# EAGLE design board (EAGLE 7.2.0)
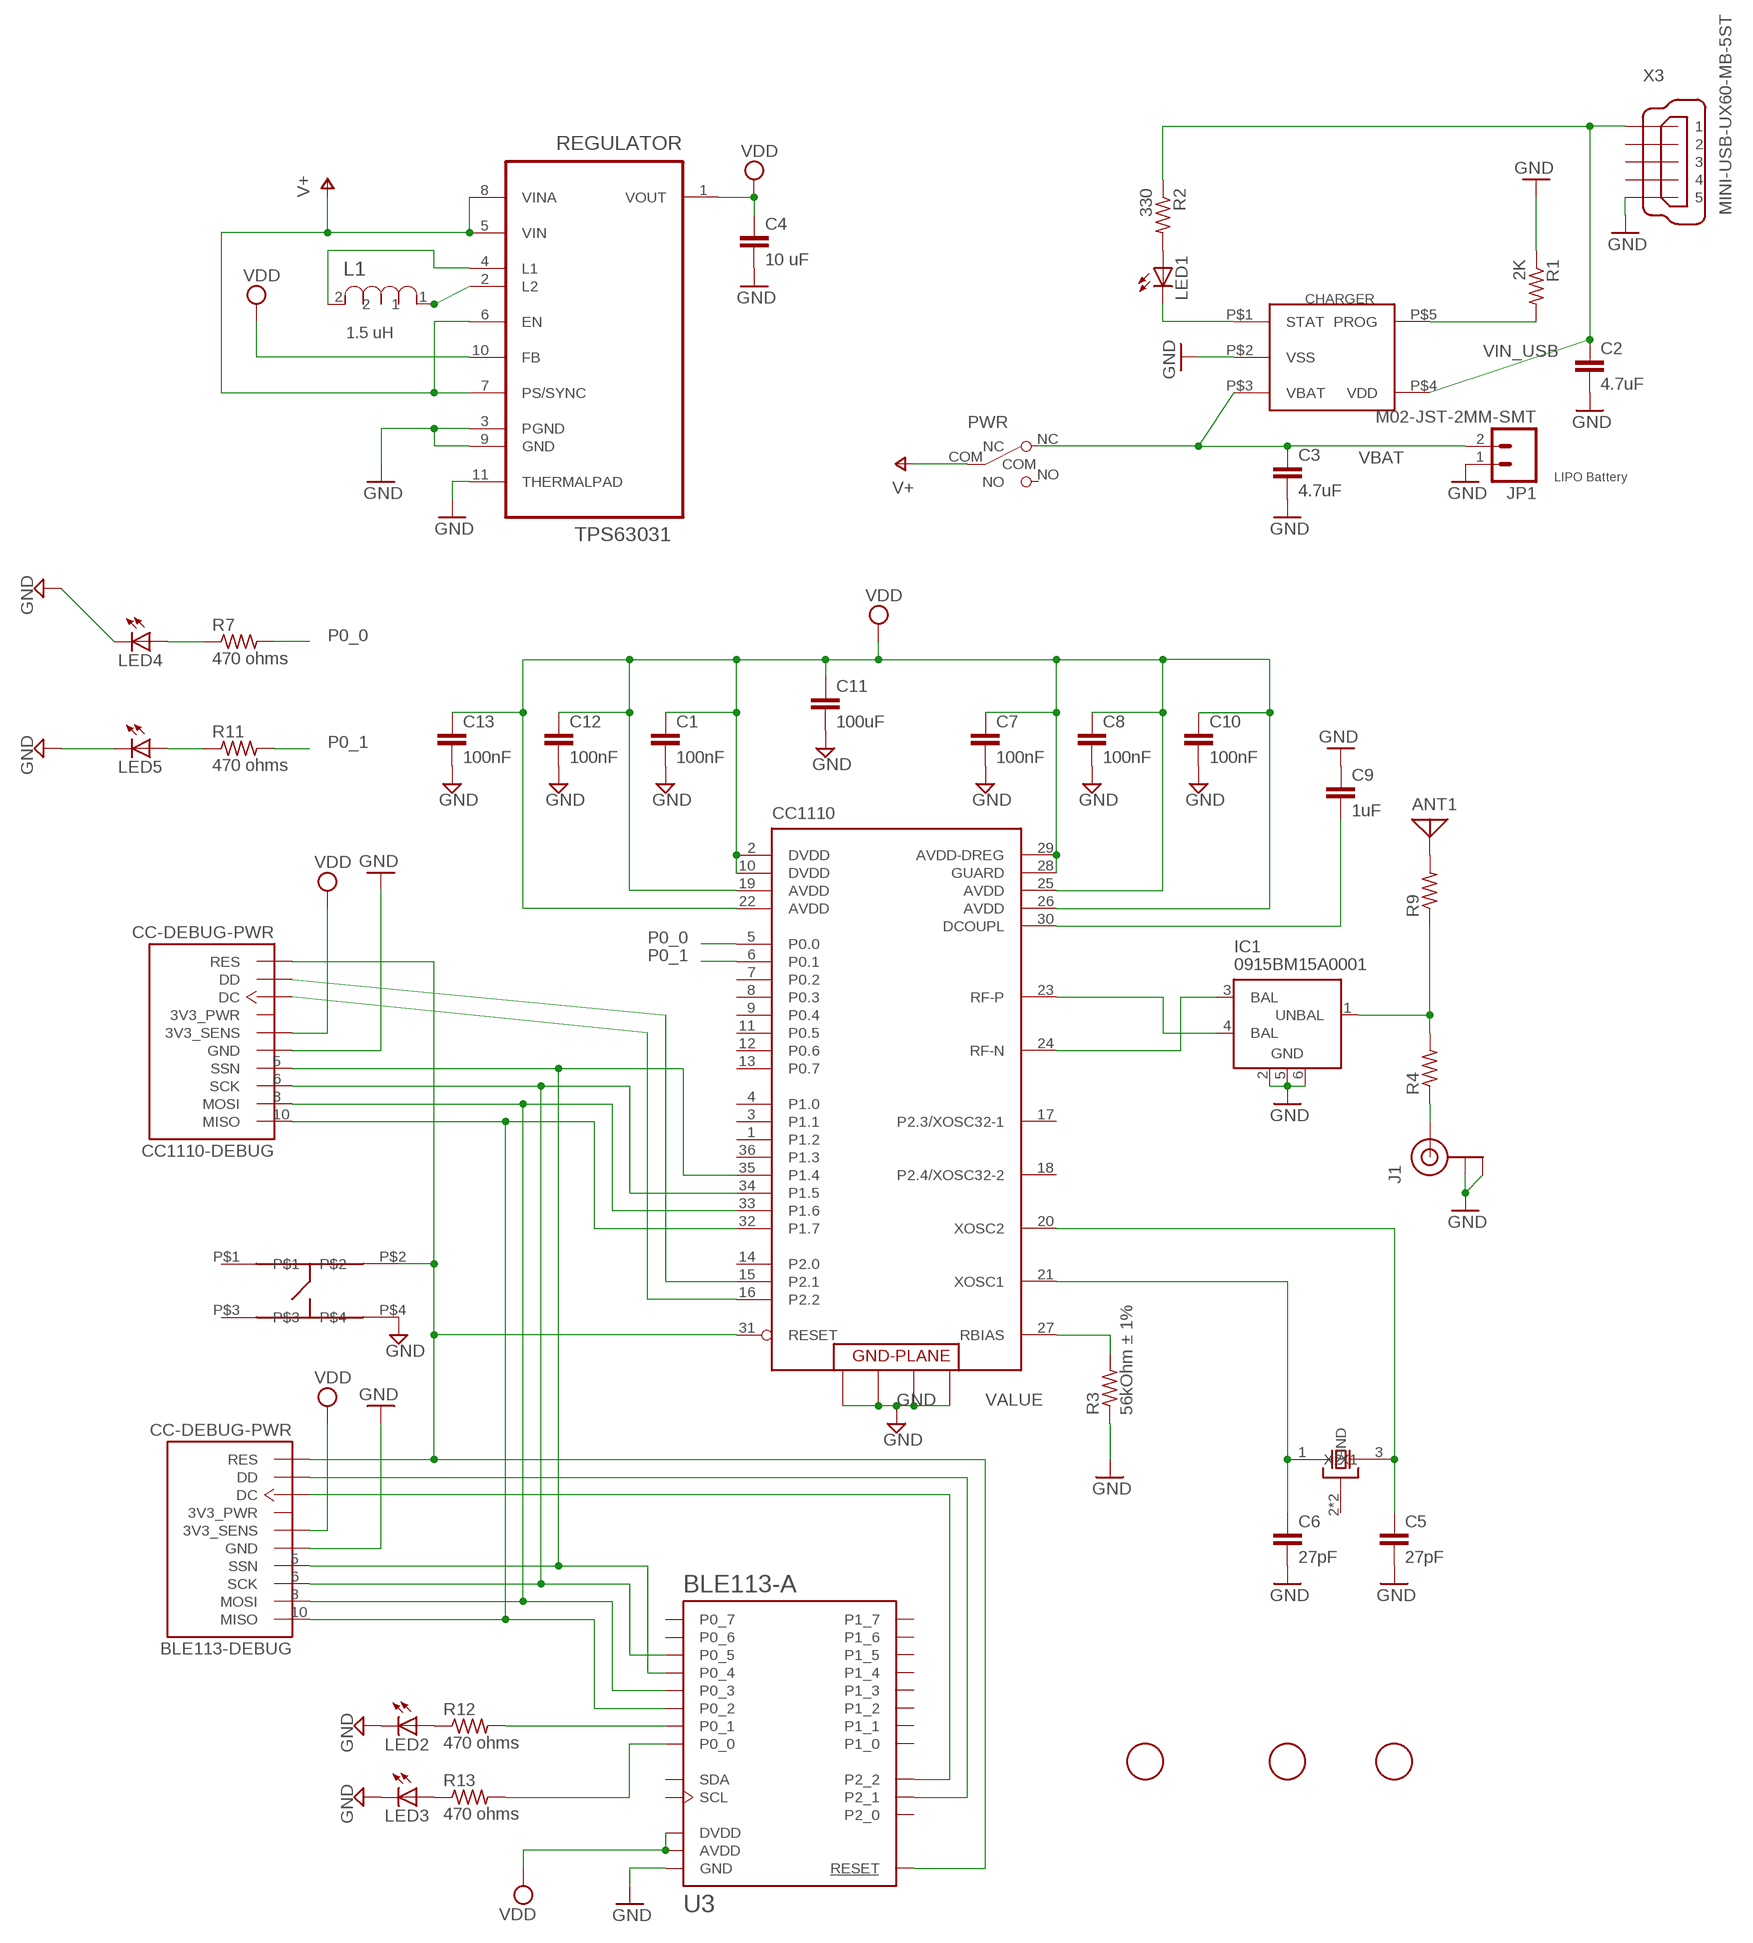
[diagram p0: schematic, sheet 1]

## Parts
ANT1  ANTENNA  [PAD-01]
BLE113-DEBUG  CC-DEBUG-PWR  [CC-P05]
C1  100nF  C-EUC0402  [C0402]
C2  4.7uF  C-EUC0402K  [C0402K]
C3  4.7uF  C-EUC0603K  [C0603K]
C4  10 uF  C-EUC0805K  [C0805K]
C5  27pF  C-EUC0402K  [C0402K]
C6  27pF  C-EUC0402K  [C0402K]
C7  100nF  C-EUC0402  [C0402]
C8  100nF  C-EUC0402  [C0402]
C9  1uF  C-EUC0402K  [C0402K]
C10  100nF  C-EUC0402  [C0402]
C11  100uF  C-EUC0402  [C0402]
C12  100nF  C-EUC0402  [C0402]
C13  100nF  C-EUC0402  [C0402]
CC1110  CC1110  [QLP-36_UPDATE]
CC1110-DEBUG  CC-DEBUG-PWR  [CC-P05]
CHARGER  MCP73831  [5PIN_SOT23]
FID1  FIDUCIAL  [FIDUCIAL_1MM]
FID2  FIDUCIAL  [FIDUCIAL_1MM]
FID3  FIDUCIAL  [FIDUCIAL_1MM]
IC1  0915BM15A0001  [0915BM15A0001]
J1  U.FL  [U.FL]
JP1  M02-JST-2MM-SMT  [JST-2-SMD]
L1  1.5 uH  PM0603-R12J-RC  [INDC1610X12N]
LED1  LEDSML0603  [SML0603]
LED2  LEDSML0603  [SML0603]
LED3  LEDSML0603  [SML0603]
LED4  LEDSML0603  [SML0603]
LED5  LEDSML0603  [SML0603]
PWR  SW_SLIDE  [SLIDE_SWITCH_SMD]
R1  2K  R-US_R0402  [R0402]
R2  330  R-US_R0402  [R0402]
R3  56kOhm ± 1%  R-US_R0402  [R0402]
R4  R-US_R0402  [R0402]
R7  470 ohms  R-US_R0402  [R0402]
R9  R-US_R0402  [R0402]
R11  470 ohms  R-US_R0402  [R0402]
R12  470 ohms  R-US_R0402  [R0402]
R13  470 ohms  R-US_R0402  [R0402]
REGULATOR  TPS63031  [SON50P260X260X80-11N]
U3  BLE113-A  [BLE113-A]
U$2  TACTILE_SWITCH  [PTS540]
X1  26MHz 10pF 10ppm -20C +70C  CTS_32X25_SMD  [CTS_32X25]
X3  MINI-USB-UX60-MB-5ST  [UX60-MB-5ST]

## Nets
DC: CC1110-DEBUG.3(DC) CC1110.16(P2.2)
DC_BLE: BLE113-DEBUG.3(DC) U3.P2_2
DD: CC1110-DEBUG.4(DD) CC1110.15(P2.1)
DD_BLE: BLE113-DEBUG.4(DD) U3.P2_1
GND: BLE113-DEBUG.1(GND) C1.2 C2.2 C3.2 C4.2 C5.2 C6.2 C7.2 C8.2 C9.1 C10.2 C11.2 C12.2 C13.2 CC1110-DEBUG.1(GND) CC1110.37(GND) CC1110.38(GND) CC1110.39(GND) CC1110.40(GND) CHARGER.P$2(VSS) IC1.2(GND) IC1.5(GND) IC1.6(GND) J1.P$1(GND) J1.P$2(GND) JP1.1 LED2.C LED3.C LED4.C LED5.C R1.1 R3.1 REGULATOR.3(PGND) REGULATOR.9(GND) REGULATOR.11(THERMALPAD) U3.GND U3.GND@2(GND) U3.GND@3(GND) U3.GND@4(GND) U3.GND@5(GND) U3.GND@6(GND) U3.GND@7(GND) U3.GND@8(GND) U3.GND@9(GND) U3.GND@10(GND) U$2.P$4 X3.5
MISO: BLE113-DEBUG.10(MISO) CC1110-DEBUG.10(MISO) CC1110.32(P1.7) U3.P0_2
MOSI: BLE113-DEBUG.8(MOSI) CC1110-DEBUG.8(MOSI) CC1110.33(P1.6) U3.P0_3
N$1: L1.1 REGULATOR.2(L2)
N$2: CHARGER.P$1(STAT) LED1.C
N$3: CHARGER.P$5(PROG) R1.2
N$4: LED1.A R2.2
N$5: CC1110.24(RF-N) IC1.3(BAL)
N$6: L1.2 REGULATOR.4(L1)
N$7: CC1110.23(RF-P) IC1.4(BAL)
N$9: J1.P$3(SIGNAL) R4.1
N$10: IC1.1(UNBAL) R4.2 R9.1
N$12: ANT1.1 R9.2
N$14: CC1110.27(RBIAS) R3.2
N$18: C9.2 CC1110.30(DCOUPL)
N$20: C6.1 CC1110.21(XOSC1) X1.1(X1)
N$21: C5.1 CC1110.20(XOSC2) X1.3(X2)
N$24: LED4.A R7.1
N$25: LED5.A R11.1
N$29: LED2.A R12.1
N$30: LED3.A R13.1
N$31: R12.2 U3.P0_1
N$32: R13.2 U3.P0_0
P0_0: CC1110.5(P0.0) R7.2
P0_1: CC1110.6(P0.1) R11.2
RESET: BLE113-DEBUG.7(RES) CC1110-DEBUG.7(RES) CC1110.31(RESET) U3.RESET U$2.P$2
SCK: BLE113-DEBUG.6(SCK) CC1110-DEBUG.6(SCK) CC1110.34(P1.5) U3.P0_5
SSN: BLE113-DEBUG.5(SSN) CC1110-DEBUG.5(SSN) CC1110.35(P1.4) U3.P0_4
V+: PWR.COM REGULATOR.5(VIN) REGULATOR.6(EN) REGULATOR.7(PS/SYNC) REGULATOR.8(VINA)
VBAT: C3.1 CHARGER.P$3(VBAT) JP1.2 PWR.NC
VDD: BLE113-DEBUG.2(3V3_SENS) C1.1 C4.1 C7.1 C8.1 C10.1 C11.1 C12.1 C13.1 CC1110-DEBUG.2(3V3_SENS) CC1110.2(DVDD) CC1110.10(DVDD) CC1110.19(AVDD) CC1110.22(AVDD) CC1110.25(AVDD) CC1110.26(AVDD) CC1110.28(GUARD) CC1110.29(AVDD-DREG) REGULATOR.1(VOUT) REGULATOR.10(FB) U3.AVDD U3.DVDD
VIN_USB: C2.1 CHARGER.P$4(VDD) R2.1 X3.1
Unconnected: BLE113-DEBUG.9(3V3_PWR) CC1110-DEBUG.9(3V3_PWR) CC1110.1(P1.2) CC1110.3(P1.1) CC1110.4(P1.0) CC1110.7(P0.2) CC1110.8(P0.3) CC1110.9(P0.4) CC1110.11(P0.5) CC1110.12(P0.6) CC1110.13(P0.7) CC1110.14(P2.0) CC1110.17(P2.3/XOSC32-1) CC1110.18(P2.4/XOSC32-2) CC1110.36(P1.3) PWR.NO U3.P0_6 U3.P0_7 U3.P1_0 U3.P1_1 U3.P1_2 U3.P1_3 U3.P1_4 U3.P1_5 U3.P1_6 U3.P1_7 U3.P2_0 U3.SCL U3.SDA U$2.P$1 U$2.P$3 X3.2 X3.3 X3.4

## Notes on the sheet
- LIPO Battery

## Power pins joined to a net without a drawn wire
GND: X1.2(GND) X1.4(GND)

## Library data of the parts
ANT1 = discrete:ANTENNA: Antenna
BLE113-DEBUG CC1110-DEBUG = parts:CC-DEBUG-PWR: CC debugger connection with various form factors. 2x5-pin 0.05" pitch header include Pin 9 (VDD) supply connection as separate pin. https://github.com/jrowberg/sf-oshw Last updated 2014-01-04 by Jeff Rowberg <jeff@rowberg.net>
C1-C13 = rcl:C-EU: CAPACITOR
CC1110 = parts:CC1110: True System-on-Chip with Low Power RF Transceiver and 8051 MCU
CHARGER = parts:MCP73831: Digikey No:- __MCP73831T-2ACI/OTCT-ND__
FID1-FID3 = adafruit:FIDUCIAL: For use by pick and place machines to calibrate the vision/machine, 1mm By microbuilder.eu
IC1 = parts:0915BM15A0001: 915 MHz Impedance Matched Balun-Filter For TI CC11xx Chipset family Data sheet <http://www.johansontechnology.com/datasheets/chipset-specific/0915BM15A0001.pdf>
J1 = SparkFun-Connectors:U.FL: SMD antenna connector- WRL-09144; PROD_ID: CONN-09193
JP1 = SparkFun-Connectors:M02: Standard 2-pin 0.1" header. Use with - straight break away headers ( PRT-00116) - right angle break away headers (PRT-00553) - swiss pins (PRT-00743) - machine pins (PRT-00117) - female headers (PRT-00115) Molex polarized connector foot print use with: PRT-08233 with associated crimp pins and housings. 2.54_SCREWTERM for use with PRT-10571. 3.5mm Screw Terminal footprints for PRT-08084 5mm Screw Terminal footprints for use with PRT-08432; PROD_ID: CONN-08352
L1 = Bourns_By_element14_Batch_1:PM0603-R12J-RC: CHIP INDUCTOR, 120NH, 300MA, 5%, 1300MHZ; MPN: PM0603-R12J-RC; OC_FARNELL: -; OC_NEWARK: 86K1771; SUPPLIER: BOURNS; TOLERANCE: ±5 %; VALUE: 120 nH
LED1-LED5 = led:LED: LED OSRAM: - CHIPLED LG R971, LG N971, LY N971, LG Q971, LY Q971, LO R971, LY R971 LH N974, LH R974 LS Q976, LO Q976, LY Q976 LO Q996 - Hyper CHIPLED LW Q18S LB Q993, LB Q99A, LB R99A - SideLED LS A670, LO A670, LY A670, LG A670, LP A670 LB A673, LV A673, LT A673, LW A673 LH A674 LY A675 LS A676, LA A676, LO A676, LY A676, LW A676 LS A679, LY A679, LG A679 - Hyper Micro SIDELED® LS Y876, LA Y876, LO Y876, LY Y876 LT Y87S - SmartLED LW L88C, LW L88S LB L89C, LB L89S, LG L890 LS L89K, LO L89K, LY L89K LS L896, LA L896, LO L896, LY L896 - TOPLED LS T670, LO T670, LY T670, LG T670, LP T670 LSG T670, LSP T670, LSY T670, LOP T670, LYG T670 LG T671, LOG T671, LSG T671 LB T673, LV T673, LT T673, LW T673 LH T674 LS T676, LA T676, LO T676, LY T676, LB T676, LH T676, LSB T676, LW T676 LB T67C, LV T67C, LT T67C, LS T67K, LO T67K, LY T67K, LW E67C LS E67B, LA E67B, LO E67B, LY E67B, LB E67C, LV E67C, LT E67C LW T67C LS T679, LY T679, LG T679 LS T770, LO T770, LY T770, LG T770, LP T770 LB T773, LV T773, LT T773, LW T773 LH T774 LS E675, LA E675, LY E675, LS T675 LS T776, LA T776, LO T776, LY T776, LB T776 LHGB T686 LT T68C, LB T68C - Hyper Mini TOPLED® LB M676 - Mini TOPLED Santana® LG M470 LS M47K, LO M47K, LY M47K Source: http://www.osram.convergy.de LUXEON: - LUMILED® LXK2-PW12-R00, LXK2-PW12-S00, LXK2-PW14-U00, LXK2-PW14-V00 LXK2-PM12-R00, LXK2-PM12-S00, LXK2-PM14-U00 LXK2-PE12-Q00, LXK2-PE12-R00, LXK2-PE12-S00, LXK2-PE14-T00, LXK2-PE14-U00 LXK2-PB12-K00, LXK2-PB12-L00, LXK2-PB12-M00, LXK2-PB14-N00, LXK2-PB14-P00, LXK2-PB14-Q00 LXK2-PR12-L00, LXK2-PR12-M00, LXK2-PR14-Q00, LXK2-PR14-R00 LXK2-PD12-Q00, LXK2-PD12-R00, LXK2-PD12-S00 LXK2-PH12-R00, LXK2-PH12-S00 LXK2-PL12-P00, LXK2-PL12-Q00, LXK2-PL12-R00 Source: www.luxeon.com KINGBRIGHT: KA-3528ASYC Source: www.kingbright.com
PWR = parts:SW_SLIDE
R1-R4 R7 R9 R11-R13 = rcl:R-US_: RESISTOR
REGULATOR = Texas Instruments_By_element14_Batch_1:TPS63031: HIGH EFFICIENCY SINGLE INDUCTOR BUCK-BOOST CONVERTER WITH 1-A SWITCHES; MPN: TPS63031; OC_FARNELL: 1686303; OC_NEWARK: 19P7478; PACKAGE: SON-10; SUPPLIER: Texas Instruments
U3 = sf-bluegiga:BLE113: Bluetooth Low Energy single-mode module - Bluetooth 4.0 (CC2541). BLE113-A variant has an on-module ceramic chip antenna. BLE113-A variant includes keepout/restrict area. Antenna edge of the module should be flush up against the edge of the PCB. See datasheet for variant layout details. The BLE113 is a Bluetooth Smart module targeted for small and low-power sensors and accessories. It integrates all features required for a Bluetooth Smart application, including Bluetooth radio, software stack, and GATT-based profiles. The BLE113 Bluetooth Smart module can also host end-user applications, which means no external micro controller is required in size or price constrained devices. Moreover, it has flexible hardware interfaces to connect to different peripherals and sensors and can be powered directly from a standard 3V coin cell battery or a pair of AAA batteries. In the lowest power sleep mode it merely consumes 500 nA and will wake up within a few hundred microseconds. The BLE113 Bluetooth Smart module conusmer approximately 30% less power and is smaller than the BLE112 Bluetooth Smart Module. http://www.bluegiga.com/en-US/products/bluetooth-4.0-modules/ble113-bluetooth--smart-module https://github.com/jrowberg/sf-oshw Last updated 2014-01-04 by Jeff Rowberg <jeff@rowberg.net>; ANTENNA: On-module ceramic chip antenna
U$2 = parts:TACTILE_SWITCH: Ultra Low Profile SMT Top Actuated PTS540 JM035 SMTR LFS Datasheet <http://www.mouser.com/ds/2/60/PTS540_9sept14-372441.pdf>
X1 = cts_crystal:CTS_32X25_SMD
X3 = con-hirose:MINI-USB-: MINI USB Connector Source: http://www.hirose.co.jp/cataloge_hp/e24000019.pdf; OC_FARNELL: unknown; OC_NEWARK: unknown

## Board
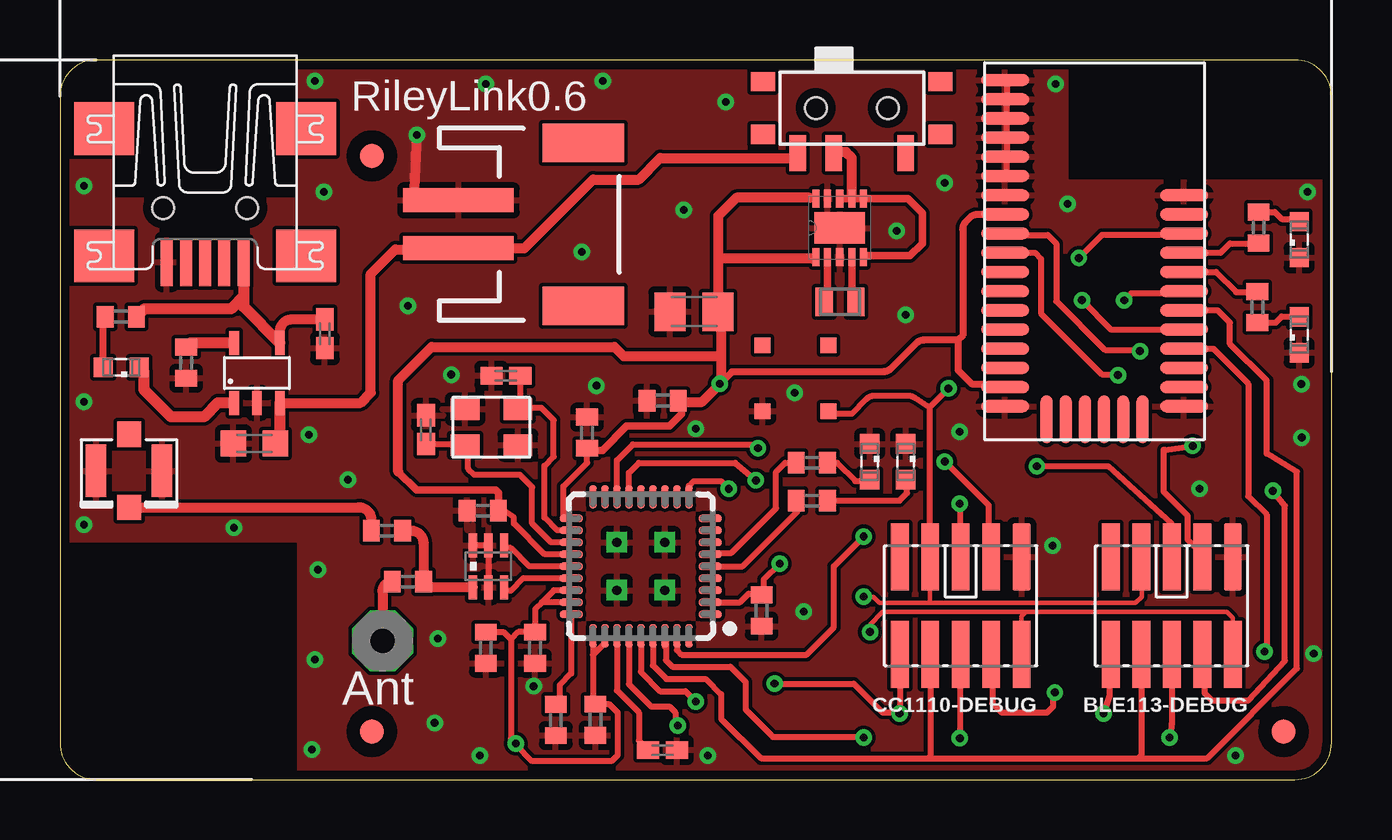
[diagram p1: board, top side]
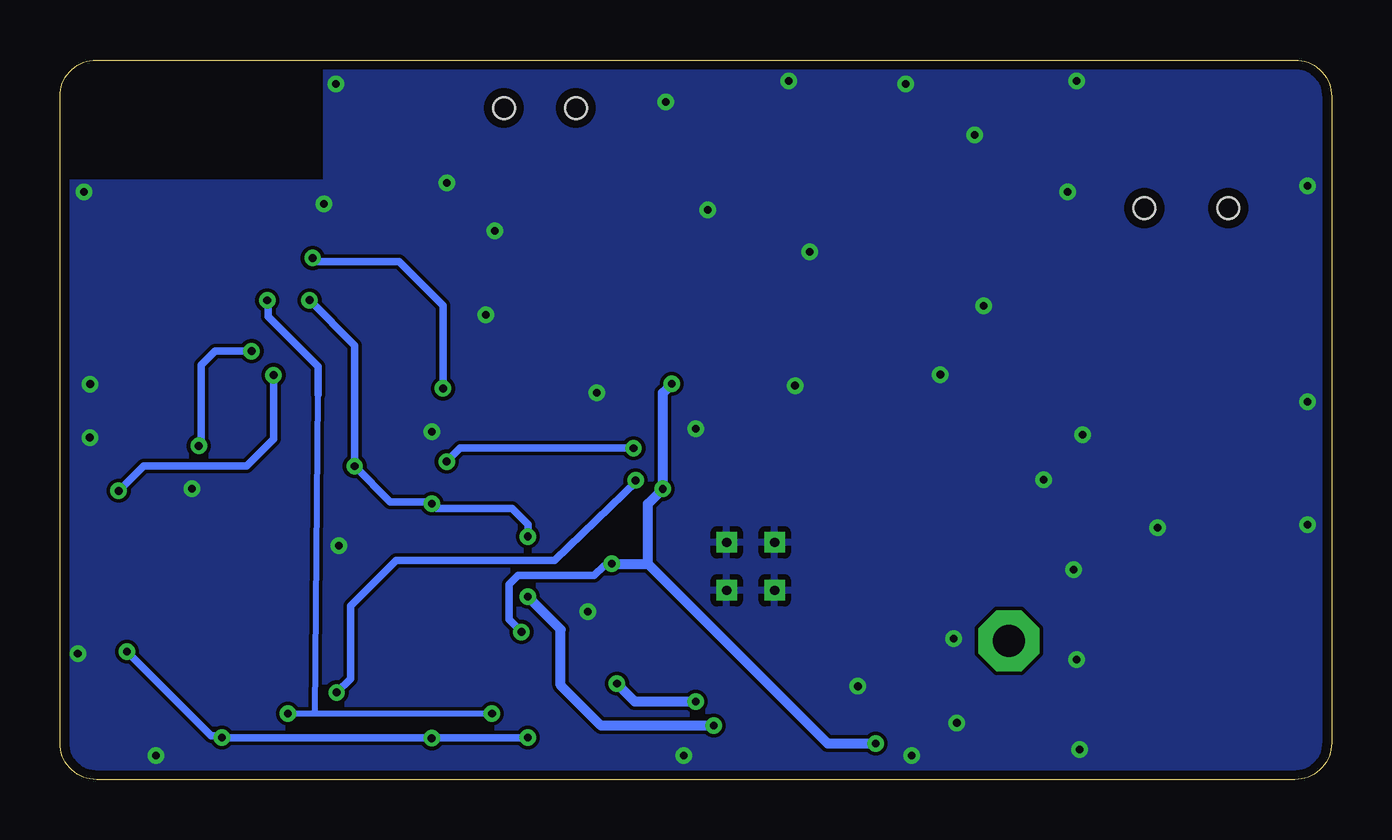
[diagram p2: board, bottom side, seen from below]

Size 53 x 30 mm. Coordinates in mm from the lower left corner, seen from the top.
Outline: 0,28.48 0,1.52 arc90 1.52,0 51.48,0 arc90 53,1.52 53,28.48 arc90 51.48,30 1.52,30 arc90 0,28.48
Copper layers (1*16): Top 0.0356mm / dielectric 1.5011mm / Bottom 0.0356mm
Design rules "oshpark *": minimum track width 6mil, minimum drill 13mil, track to track 6mil, track to pad 6mil, pad to pad 6mil, via to via 6mil, smd to smd 6mil, copper to edge 15mil, drill to drill 6mil, minimum pad ring 7mil, minimum via ring 7mil, stop-mask expansion 3mil, vias tented up to drill 21mil, thermal gap 10mil

### Footprints (pad centres in the part's own frame; a part is rotated, then mirrored left to right if it is on the bottom)
PAD-01 = drill 1.321 pad 2.54 octagon: 1 0,0
CC-P05 = smd 0.74 x 2.8: 1 -2.54,-2.03; 2 -2.54,2.03; 3 -1.27,-2.03; 4 -1.27,2.03; 5 0,-2.03; 6 0,2.03; 7 1.27,-2.03; 8 1.27,2.03; 9 2.54,-2.03; 10 2.54,2.03
C0402 = smd 0.7 x 0.9: 1 -0.65,0; 2 0.65,0
C0402K = smd 0.925 x 0.74: 1 -0.6,0; 2 0.6,0
C0603K = smd 1.05 x 1.08: 1 -0.875,0; 2 0.875,0
C0805K = smd 1.3 x 1.6: 1 -1,0; 2 1,0
QLP-36_UPDATE = smd 0.95 x 0.3: 1 -2.9,2; 2 -2.9,1.5; 3 -2.9,1; 4 -2.9,0.5; 5 -2.9,0; 6 -2.9,-0.5; 7 -2.9,-1; 8 -2.9,-1.5; 9 -2.9,-2; 19 2.9,-2; 20 2.9,-1.5; 21 2.9,-1; 22 2.9,-0.5; 23 2.9,0; 24 2.9,0.5; 25 2.9,1; 26 2.9,1.5; 27 2.9,2 | smd 0.3 x 0.95: 10 -2,-2.9; 11 -1.5,-2.9; 12 -1,-2.9; 13 -0.5,-2.9; 14 0,-2.9; 15 0.5,-2.9; 16 1,-2.9; 17 1.5,-2.9; 18 2,-2.9; 28 2,2.9; 29 1.5,2.9; 30 1,2.9; 31 0.5,2.9; 32 0,2.9; 33 -0.5,2.9; 34 -1,2.9; 35 -1.5,2.9; 36 -2,2.9 | drill 0.381 pad 0.85 square: 37 -1,1; 38 1,1; 39 -1,-1; 40 1,-1
5PIN_SOT23 = smd 0.4 x 1: P$1 0.4,-0.63; P$2 1.35,-0.63; P$3 2.3,-0.63; P$4 2.3,1.87; P$5 0.4,1.87
FIDUCIAL_1MM = smd 1 x 1: 1 0,0
0915BM15A0001 = smd 0.35 x 1: 1 -0.65,-0.875; 2 0,-0.875; 3 0.65,-0.875; 4 0.65,0.875; 5 0,0.875; 6 -0.65,0.875
U.FL = smd 2.2 x 0.85: P$1 0,1.375; P$2 0,-1.375 | smd 1.05 x 1: P$3 1.525,0; P$4 -1.525,0
JST-2-SMD = smd 1 x 4.6: 1 -1,-3.7; 2 1,-3.7 | smd 1.6 x 3.4: NC1 -3.4,1.5; NC2 3.4,1.5
INDC1610X12N = smd 0.711 x 1.194: 1 -0.66,0; 2 0.66,0
SML0603 = smd 0.8 x 0.8: A 0.75,0; C -0.75,0
SLIDE_SWITCH_SMD = smd 0.7 x 1.5: COM 0.75,1.875; NC 2.25,1.875; NO -2.25,1.875 | smd 1 x 0.8: P$1 -3.7,-1.1; P$2 -3.7,1.1; P$3 3.7,1.1; P$4 3.7,-1.1 | hole 0.9: -1.5,0; 1.5,0
R0402 = smd 0.7 x 0.9: 1 -0.65,0; 2 0.65,0
SON50P260X260X80-11N = smd 0.762 x 0.305: 1 -1.219,0.991; 2 -1.219,0.508; 3 -1.219,0; 4 -1.219,-0.508; 5 -1.219,-0.991; 6 1.219,-0.991; 7 1.219,-0.508; 8 1.219,0; 9 1.219,0.508; 10 1.219,0.991 | smd 1.295 x 2.108: 11 0,0
BLE113-A = smd 2 x 0.5: AVDD -3.725,1.538; DVDD -3.725,-5.662; GND -3.725,7.138; GND@2 -3.725,6.338; GND@3 -3.725,5.537; GND@4 -3.725,4.737; GND@5 -3.725,3.938; GND@6 -3.725,3.138; GND@7 -3.725,2.337; GND@8 -3.725,-6.463; GND@9 3.725,-6.463; GND@10 3.725,2.337; NC -3.725,-4.862; NC@2 3.725,1.538; P0_0 3.725,-0.062; P0_1 3.725,-0.863; P0_2 3.725,-1.663; P0_3 3.725,-2.462; P0_4 3.725,-3.263; P0_5 3.725,-4.062; P0_6 3.725,-4.862; P0_7 3.725,-5.662; P1_6 -3.725,-2.462; P1_7 -3.725,-1.663; P2_0 -3.725,-0.863; P2_1 -3.725,-0.062; P2_2 -3.725,0.738; RESET 3.725,0.738; SCL -3.725,-3.263; SDA -3.725,-4.062 | smd 0.5 x 2: P1_0 2,-7.013; P1_1 1.2,-7.013; P1_2 0.4,-7.013; P1_3 -0.4,-7.013; P1_4 -1.2,-7.013; P1_5 -2,-7.013
PTS540 = smd 0.65 x 0.65: P$1 -1.375,1.375; P$2 1.375,1.375; P$3 -1.375,-1.375; P$4 1.375,-1.375
CTS_32X25 = smd 1.2 x 0.9: 1 -1.1,-0.7; 2 1.1,-0.7; 3 1.1,0.8; 4 -1.1,0.8
UX60-MB-5ST = smd 2 x 0.5: 1 2.25,1.6; 2 2.25,0.8; 3 2.25,0; 4 2.25,-0.8; 5 2.25,-1.6 | smd 2.2 x 2.5: M1 -3.3,-4.2; M2 -3.3,4.2; M3 2,4.2; M4 2,-4.2 | hole 0.9: 0,-1.75; 0,1.75

### Placement (x,y rotation side)
ANT1  13.45,5.78 0 top
BLE113-DEBUG  46.34,7.25 180 top
C1  29.24,7.04 270 top
C2  11.04,18.59 270 top
C3  8.1,14.01 180 top
C4  26.43,19.5 180 top
C5  18.59,16.84 180 top
C6  15.26,14.59 90 top
C7  22.32,2.5 270 top
C8  17.75,5.5 270 top
C9  25.11,1.23 180 top
C10  19.8,5.5 270 top
C11  25.12,15.8 180 top
C12  21.97,14.46 90 top
C13  17.62,11.21 180 top
CC1110  24.21,8.89 180 top
CC1110-DEBUG  37.55,7.25 180 top
CHARGER  6.86,16.33 0 top
FID1  13,2 0 top
FID2  13,26 0 top
FID3  51,2 0 top
IC1  17.86,8.89 0 top
J1  2.88,12.88 270 top
JP1  20.31,23.15 270 top
L1  32.52,19.92 0 top
LED1  2.55,17.19 180 top
LED2  51.65,18.54 90 top
LED3  51.65,22.51 90 top
LED4  35.25,13.25 270 top
LED5  33.75,13.25 270 top
PWR  33,28 180 top
R1  5.26,17.38 90 top
R2  2.54,19.3 180 top
R3  20.66,2.48 90 top
R4  13.62,10.38 0 top
R7  31.34,11.63 180 top
R9  14.5,8.25 180 top
R11  31.34,13.21 180 top
R12  49.91,19.7 90 top
R13  49.96,23.01 270 top
REGULATOR  32.5,23 90 top
U3  43.12,22.02 0 top
U$2  30.66,16.73 270 top
X1  17.98,14.64 0 top
X3  6.05,23.83 270 top

### Tracks (layer width: path | path; a pad name or v marks a point on that pad's centre or on a via)
DC  (via drill 0.33)
  Top 0.152: 38.71,9.3 CC1110-DEBUG.3
  Top 0.24: v36.88,13.26 38.71,11.43 38.71,9.3
  Top 0.254: CC1110.16 23.21,13.3 23.88,13.97 28.94,13.97 v29.09,13.81
  Bottom 0.305: v29.09,13.81 36.33,13.81 v36.88,13.26
DC_BLE  (via drill 0.33)
  Top 0.152: 40.08,22.71 39.47,22.71 U3.P2_2 | 47.55,9.3 BLE113-DEBUG.3
  Top 0.24: 47.55,9.3 47.55,9.45 47,10 47,11 46,12 46,13.75 46.06,13.75 v47.22,13.91
  Top 0.254: 40.08,22.71 41.17,22.71 41.53,22.35 41.53,19.94 43.56,17.91 44.8,17.91 v45.01,17.86
  Bottom 0.305: v45.01,17.86 46.53,17.86 47.12,17.27 47.12,14.01 v47.22,13.91
DD  (via drill 0.33)
  Top 0.152: 38.86,4.27 38.86,5.18 CC1110-DEBUG.4
  Top 0.254: CC1110.15 23.71,12.79 24.13,13.21 28.14,13.21 v29.01,12.47 | 38.86,4.27 38.86,3.17 39.24,2.79 41.15,2.79 41.4,3.05 41.4,3.56 v41.47,3.63
  Bottom 0.305: v29.01,12.47 28.93,12.47 32.38,9.14 38.99,9.14 40.89,7.24 40.89,4.2 v41.47,3.63
DD_BLE  (via drill 0.33)
  Top 0.152: 47.7,4.27 47.7,5.18 BLE113-DEBUG.4
  Top 0.254: 47.7,4.27 47.7,3.61 48.01,3.3 49.53,3.3 51.05,4.95 51.05,11.41 v50.55,12.04 | U3.P2_1 40.65,21.96 40.89,21.72 40.89,19.43 43.43,16.89 44.07,16.89 v44.1,16.86
  Bottom 0.305: v44.1,16.86 44.1,14.2 45.21,13.08 49.51,13.08 v50.55,12.04
GND  (via drill 0.33, 0.33 pad 0.41)
  Top 0.152: 39.47,28.5 U3.GND@2 39.47,28.35 | 39.47,29.11 U3.GND | 39.47,26.06 U3.GND@5 39.47,25.91 | 39.47,26.67 U3.GND@4 39.47,26.82 | 39.47,27.43 U3.GND@3 39.47,27.58 | 39.47,25.3 U3.GND@6
  Top 0.24: 39.47,29.11 39.47,28.5 | 39.47,26.67 39.47,26.06 | 39.47,26.82 39.47,27.43 | 39.47,27.58 39.47,28.35 | 39.47,25.3 39.47,25.91
  Top 0.26: C10.2 20,5 | IC1.2 IC1.5 IC1.6
  Top 0.406: JP1.1 14.75,24.15 v14.88,26.88
  other vias: 10.75,8.75 11,24.5 26,23.75 27.75,28.25 34.88,22.88 52,24.5 21.75,22 51.75,16.48 52.25,5.25 51.75,14.26 49,1 41.38,9.75 16.3,16.88 10.38,14.38 14.5,19.75 10.62,5 15.75,5.88 17.5,1 12,12.5 41.5,29 42,24 31,7 19.75,3.89 27,1 47.5,12.12 37.5,14.5 35.25,19.38 1,10.62 7.25,10.5 1,15.75 1,24.75 36.88,24.88 22.62,29.12 17.75,29 10.62,29.12 10.5,1.25 15.62,2.36 22.36,16.42 26.5,14.62 30.62,16.12
  pour Bottom: 0,30 53,30 53,0 0,0
  pour Top: 10,0 10,10 0,10 0,30 53,30 53,0
MISO  (via drill 0.33)
  Top 0.152: 46.02,20.27 46.79,20.27 U3.P0_2
  Top 0.24: v43.5,2.75 43.75,3.5 43.75,5.17 BLE113-DEBUG.10
  Top 0.254: CC1110.32 24.21,4.49 25.02,3.68 26.07,3.68 v26.5,3.25 | v29.79,4 33.08,4 34.29,2.79 35.21,2.79 v35,2.75 35.01,3 CC1110-DEBUG.10 | 46.02,20.27 44.65,20.27 v44.36,19.98
  Bottom 0.152: 42.37,2.74 42.37,2.75
  Bottom 0.24: v35,2.75 42.37,2.75 | 42.37,2.75 v43.5,2.75 | 42.37,2.75 42.24,16.05
  Bottom 0.305: 42.24,16.05 42.24,17.22 44.32,19.3 44.32,19.94 v44.36,19.98
  Bottom 0.406: v26.5,3.25 29.04,3.25 v29.79,4
MOSI
  Top 0.254: CC1110.33 24.71,4.75 25.27,4.19 26.92,4.19 27.56,3.56 27.56,2.54 29.21,0.89 36.2,0.89 | 36.2,0.89 44.96,0.89 | 44.96,0.89 47.82,0.89 51.56,4.63 51.56,12.83 50.29,13.59 50.29,16.64 48.77,18.16 48.77,19.05 48.26,19.56 U3.P0_3 | BLE113-DEBUG.8 45.07,1 44.96,0.89 | CC1110-DEBUG.8 36.27,0.97 36.2,0.89
N$1
  Top 0.305: REGULATOR.2 31.99,20.06 L1.1
N$2
  Top 0.45: CHARGER.P$1 6.58,15.7 6,15.12 4.62,15.12 3.5,16.25 3.5,16.99 LED1.C
N$3
  Top 0.45: CHARGER.P$5 5.43,18.2 R1.2
N$4
  Top 0.3: LED1.A 1.8,19.21 R2.2
N$5
  Top 0.254: CC1110.24 19.31,8.39 18.8,7.87 18.65,7.87 IC1.3
N$6
  Top 0.24: REGULATOR.4 33.01,21.99 33,22
  Top 0.305: 33,22 33,20.09 L1.2
N$7
  Top 0.254: CC1110.23 19.56,8.89 18.8,9.65 18.62,9.65 IC1.4
N$9
  Top 0.406: J1.P$3 12.47,11.35 arc-90 12.97,10.84 R4.1
N$10
  Top 0.24: 16.74,7.97 IC1.1 16.69,8
  Top 0.406: IC1.1 15.38,8.02 arc-90 R9.1 15.15,9.87 arc90 14.64,10.38 R4.2
N$12
  Top 0.406: R9.2 arc90 13.45,7.84 ANT1.1
N$14
  Top 0.254: CC1110.27 21.31,4.42 20.83,3.94 20.83,3.04 R3.2
N$18
  Top 0.254: CC1110.30 23.21,3.71 24.13,2.79 24.13,1.61 C9.2
N$20
  Top 0.24: C6.1 16.84,13.98 X1.1
  Top 0.254: CC1110.21 20.46,9.89 19.68,10.67 19.68,12.19 19.18,12.7 17.27,12.7 17.02,12.95 17.02,13.81 X1.1
N$21
  Top 0.24: 19.38,15.62 19,15.62 19.08,15.54 19.18,15.54 | C5.1 19.18,15.54 | 19.18,15.54 X1.3
  Top 0.254: CC1110.20 20.73,10.39 20.19,10.92 20.19,13.08 20.57,13.46 20.57,14.99 20.07,15.49 19.13,15.49 X1.3
N$24
  Top 0.254: R7.1 35,11.63 35.31,11.94 35.31,12.44 LED4.A
N$25
  Top 0.254: R11.1 32.39,13.21 33.15,12.45 33.7,12.45 LED5.A
N$29
  Top 0.254: R12.1 50.67,19.05 50.93,19.3 51.64,19.3 LED2.A
N$30
  Top 0.254: R13.1 50.63,23.66 50.93,23.37 51.54,23.37 LED3.A
N$31
  Top 0.254: U3.P0_1 48.18,21.16 49.02,20.32 49.63,20.32 R12.2
N$32
  Top 0.254: U3.P0_0 48.38,21.96 48.77,22.35 49.7,22.35 R13.2
P0_0
  Top 0.254: CC1110.5 28.45,8.89 30.73,11.18 30.73,11.59 R7.2
P0_1
  Top 0.152: 27.13,9.45 CC1110.6
  Top 0.254: 27.13,9.45 27.99,9.45 29.84,11.3 29.84,12.83 30.23,13.21 R11.2
RESET  (via drill 0.33)
  Top 0.152: 46.79,22.71 U3.RESET | 36.27,15.54 36.25,15.5
  Top 0.178: v33.5,7.62 33.9,7.62 34.16,7.37 36.2,7.37 | 36.2,7.37 44.83,7.37 45.09,7.62 45.09,9.27 BLE113-DEBUG.7 | 36.25,8.64 36.25,7.42 36.2,7.37
  Top 0.24: CC1110-DEBUG.7 36.25,8.64 36.25,15.5 35.63,15.91 arc34 35.35,16 33.96,16 arc45 33.6,15.85 33,15.25 32.14,15.25 U$2.P$2 | 36.27,15.54 v37.03,16.31
  Top 0.254: CC1110.31 23.71,3.98 24.64,3.05 25.4,3.05 25.65,2.79 25.65,2.35 v25.75,2.25 | 46.79,22.71 43.43,22.71 v42.47,21.74
  Bottom 0.305: v37.03,16.31 37.03,19.76 38.86,21.59 42.32,21.59 v42.47,21.74
  Bottom 0.406: v25.75,2.25 30.44,2.25 32.13,3.94 32.13,6.26 v33.5,7.62
SCK  (via drill 0.33)
  Top 0.24: 25.21,5.54 CC1110.34 25.25,5.95 | 37.5,4.42 CC1110-DEBUG.6 | BLE113-DEBUG.6 46.34,2.34 v46.25,1.75
  Top 0.254: 25.25,5.95 25.25,4.98 25.53,4.7 27.94,4.7 28.57,4.06 28.57,2.92 29.72,1.78 33.47,1.78 v33.5,1.75 | 37.5,4.42 v37.5,1.72 | U3.P0_5 48.08,17.96 49.53,16.51 49.53,11.81 50.29,11.05 50.29,5.42 v50.21,5.33
  Bottom 0.152: 46.33,1.83 v46.25,1.75
  Bottom 0.24: 37.47,1.75 v37.5,1.72
  Bottom 0.305: v33.5,1.75 37.47,1.75 | 37.47,1.75 v37.5,1.72 | 37.47,1.75 v46.25,1.75 | 46.33,1.83 46.7,1.83 v50.21,5.33
SSN  (via drill 0.33)
  Top 0.152: 46.79,18.75 U3.P0_4 | 46.33,10.67 46.33,9.3 BLE113-DEBUG.5
  Top 0.24: v37.5,11.5 37.5,8.57 CC1110-DEBUG.5 | 46.33,10.67 43.68,13.06 v40.72,13.06 | U3.P0_4
  Top 0.254: CC1110.35 25.71,5.41 25.91,5.21 31.11,5.21 32.26,6.35 32.26,8.89 v33.5,10.13 | U3.P0_4 43.83,18.75 v42.6,19.98
  Bottom 0.152: 37.64,11.58 v37.5,11.5
  Bottom 0.305: v33.5,10.13 33.5,10.64 34.16,11.3 37.3,11.3 v37.5,11.5 | 37.64,11.58 39.24,11.58 v40.72,13.06 40.72,18.1 v42.6,19.98
V+
  Top 0.305: REGULATOR.5 33.55,21.84 35.43,21.84 35.94,22.35 35.94,23.62 35.34,24.22 REGULATOR.6 REGULATOR.7 REGULATOR.8
  Top 0.406: REGULATOR.7 33.01,25.92 32.77,26.16 32.29,26.16 PWR.COM
VBAT
  Top 0.406: PWR.NC 30.53,25.91 25.02,25.91 24.13,25.02 22.23,25.02 19.36,22.15 JP1.2 16.56,22.1 13.97,22.1 12.95,21.08 12.95,16.13 12.53,15.7 CHARGER.P$3
  Top 0.45: CHARGER.P$3 9.16,14.19 C3.1
VDD  (via drill 0.33)
  Top 0.152: 40.23,5.33 CC1110-DEBUG.2 40.08,5.33 | 48.77,5.33 BLE113-DEBUG.2 | 38.56,16.46 39.32,16.46 U3.DVDD | C11.1 25.76,15.85 25.76,15.75
  Top 0.178: 22.73,3.17 C7.1 | v33.76,6.15 33.76,6.46 34.29,6.99 40.26,6.99 | 40.26,6.99 48.64,6.99 48.9,6.73 48.9,5.24 BLE113-DEBUG.2 | 40.08,5.33 40.08,6.81 40.26,6.99
  Top 0.24: 25.76,15.75 25.75,15.75 | CC1110.10 26.21,12.21 | 21.88,13.71 C12.1
  Top 0.254: 26.21,12.21 26.21,12.24 26.42,12.45 27.55,12.45 v27.88,12.12 | CC1110.19 20.99,10.89 20.99,12.22 21.97,13.21 C12.1 21.84,13.68 | CC1110.22 20.2,9.39 18.92,10.67 18.92,10.92 18.54,11.18 18.05,11.18 C13.1 18.03,11.23 18.21,11.23 18.29,11.3 | CC1110.26 20.09,7.39 | 20.09,7.39 19.81,7.11 19.81,6.16 | CC1110.25 20.59,7.89 20.09,7.39 | C8.1 18.49,6.15 18.8,5.84 | 18.8,5.84 18.8,1.7 v19,1.5 19,1.45 19.68,0.76 22.99,0.76 23.24,1.02 23.24,2.79 22.89,3.15 C7.1 22.21,3.13 22.21,5.21 | C10.1 19.1,6.15 18.8,5.84 | CC1110.28 22.21,5.21 | CC1110.29 22.71,5.71 22.21,5.21 | CC1110.2 28.34,7.39 28.7,7.75 29.19,7.75 | 29.19,7.75 C1.1 | 29.19,7.75 29.34,7.75 29.34,8.34 v30,9 | REGULATOR.10 31.28,24.22 31.24,24.26
  Top 0.3: v27.5,16.5 28,17 34.29,17 arc45 34.65,17.15 35.67,18.18 arc-45 36.03,18.32 37.44,18.32 | 37.44,18.32 37.44,17.06 38,16.5 38.52,16.5 38.56,16.46 | U3.AVDD 38.27,23.56 arc45 37.91,23.41 37.77,23.27 arc45 37.62,22.91 37.62,18.51 37.44,18.32 | 25.76,15.75 25.76,15.74 25.88,15.62
  Top 0.305: 21.88,13.71 22.61,13.71 23.62,14.73 25.4,14.73 25.91,15.24 25.91,15.66 C11.1 | REGULATOR.1 31.43,21.78 31.37,21.72 | 18.29,11.3 18.29,11.94 18.16,12.06 14.86,12.06 14.1,12.83 | 19.81,6.16 C10.1
  Top 0.406: 27.55,17.78 27.55,19.38 arc90 C4.1 27.43,21.59 | 27.55,17.78 27.55,16.64 | 27.55,16.64 27.55,16.46 | 31.24,24.26 28.19,24.26 27.43,23.5 27.43,21.59 | 31.37,21.72 27.56,21.72 27.43,21.59 | 14.1,12.83 14.1,16.64 15.49,18.03 23.11,18.03 23.5,17.65 27.43,17.65 27.55,17.78 | 25.76,15.75 26.75,15.75 v27.5,16.5 27.5,16.58 27.55,16.64
  Bottom 0.152: 30.02,8.99 v30,9
  Bottom 0.254: 30.33,8.91 30.07,8.99 v30.01,8.99 v30,9
  Bottom 0.305: 30.33,8.91 30.73,8.51 33.91,8.51 34.29,8.13 34.29,6.68 v33.76,6.15
  Bottom 0.406: 28.5,9 28.5,11.49 v27.88,12.12 27.88,16.12 v27.5,16.5 | v19,1.5 21,1.5 28.5,9 | v30,9 28.5,9
VIN_USB
  Top 0.406: C2.1 9.67,19.18 arc90 9.16,18.68 CHARGER.P$4
  Top 0.45: CHARGER.P$4 7.65,19.71 X3.1 7.65,20.15 7.12,19.62 3.52,19.62 R2.1

### Text on the board
tNames: RileyLink0.6 | Ant